# EAGLE design schematic (EAGLE 9.6.2)
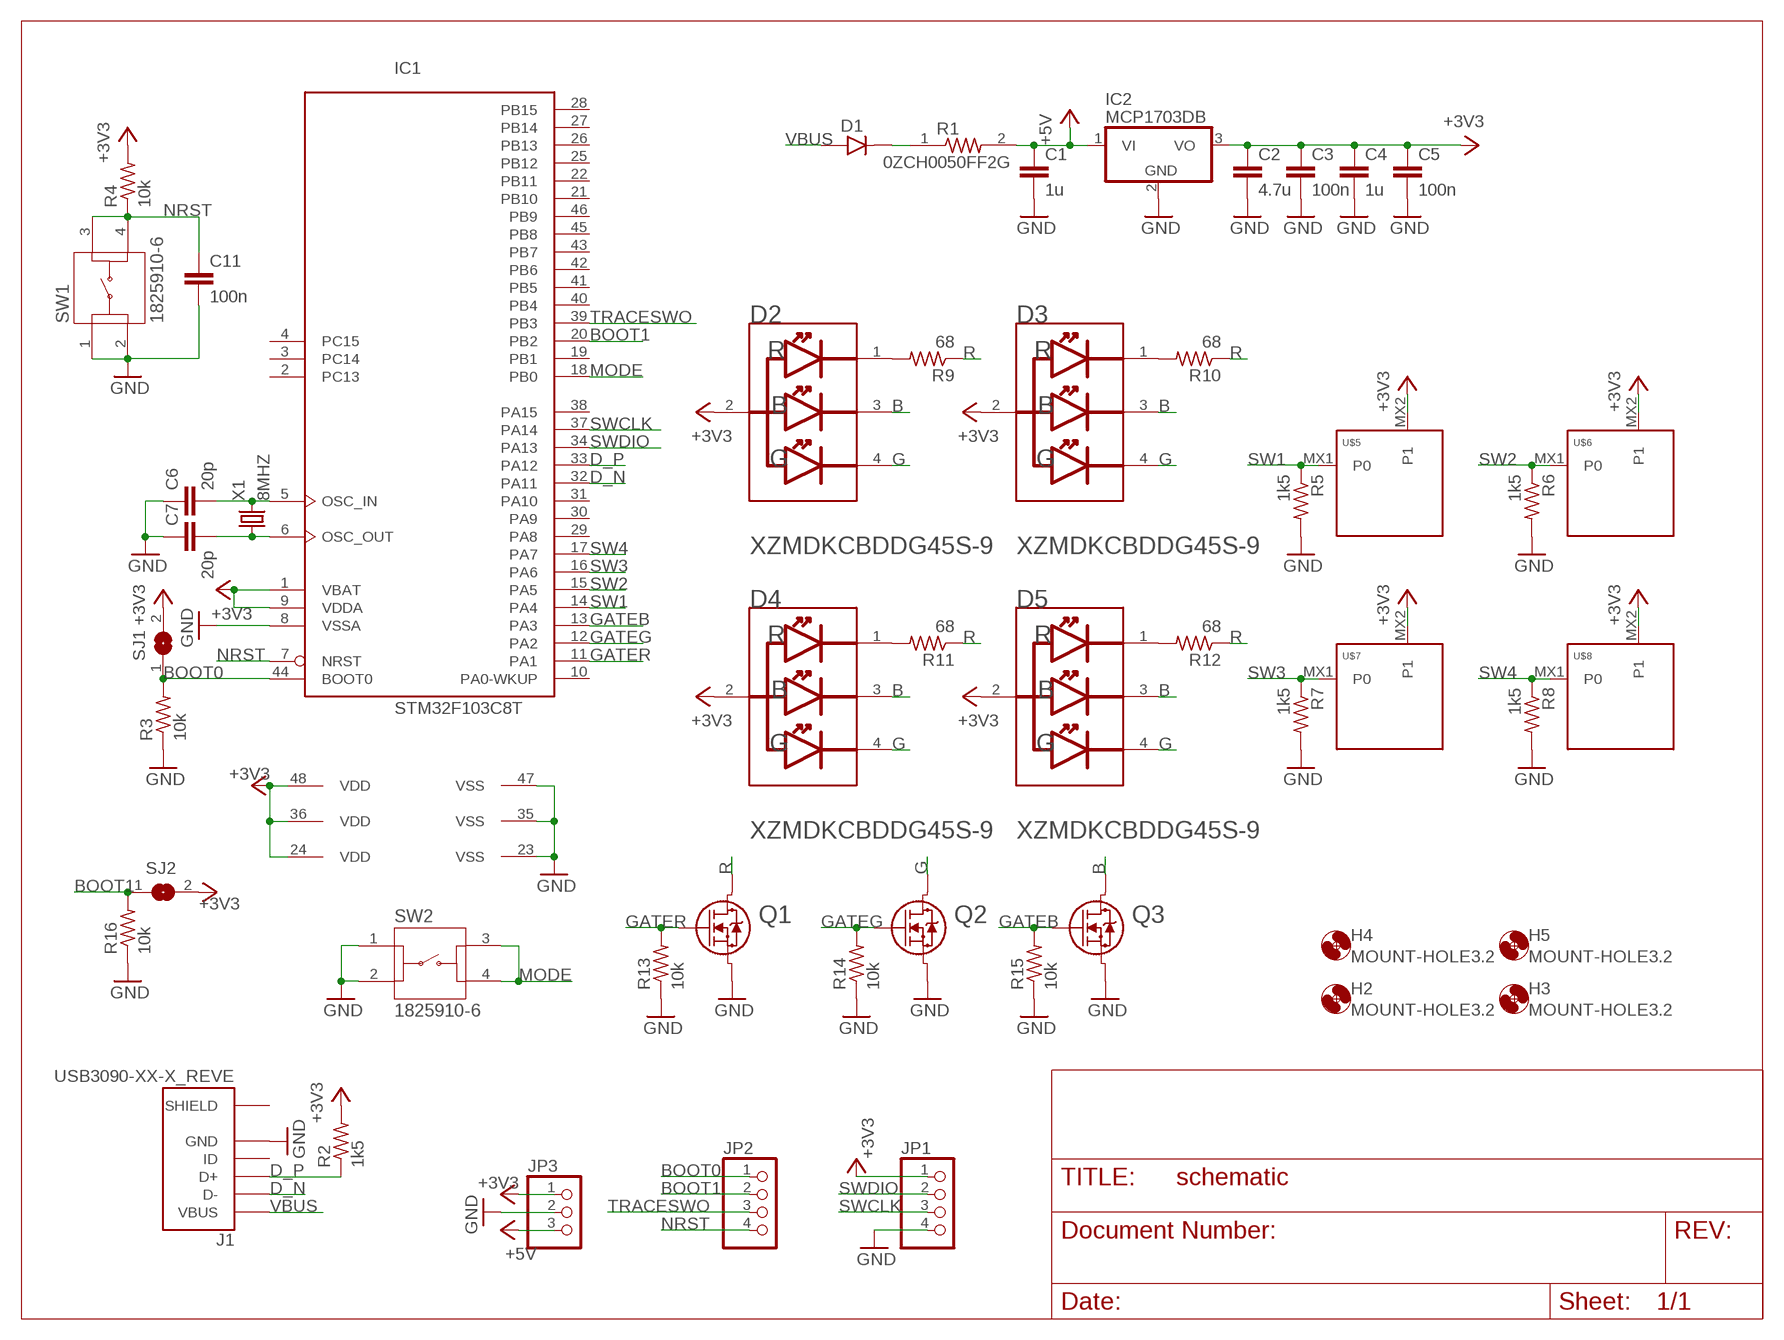
[diagram p0: schematic, sheet 1]

## Parts
C1  1u  C-EUC0805  [C0805]
C2  4.7u  C-EUC0805  [C0805]
C3  100n  C-EUC0805  [C0805]
C4  1u  C-EUC0805  [C0805]
C5  100n  C-EUC0805  [C0805]
C6  20p  C-EUC0805  [C0805]
C7  20p  C-EUC0805  [C0805]
C11  100n  C-EUC0805  [C0805]
D1  DIODE_SOD123FL  [SOD123FL]
D2  SUNLED_XZMDKCBDDG45S-9SUNLED_XZMDKCBDDG45S-9_0_0  [SUNLED_XZMDKCBDDG45S-9_0]
D3  SUNLED_XZMDKCBDDG45S-9SUNLED_XZMDKCBDDG45S-9_0_0  [SUNLED_XZMDKCBDDG45S-9_0]
D4  SUNLED_XZMDKCBDDG45S-9SUNLED_XZMDKCBDDG45S-9_0_0  [SUNLED_XZMDKCBDDG45S-9_0]
D5  SUNLED_XZMDKCBDDG45S-9SUNLED_XZMDKCBDDG45S-9_0_0  [SUNLED_XZMDKCBDDG45S-9_0]
H2  MOUNT-HOLE3.2  [3,2]
H3  MOUNT-HOLE3.2  [3,2]
H4  MOUNT-HOLE3.2  [3,2]
H5  MOUNT-HOLE3.2  [3,2]
IC1  STM32F103C8T  [LQFP48]
IC2  MCP1703DB  [SOT223]
J1  USB3090-XX-X_REVE  [GCT_USB3090-XX-X_REVE]
JP1  PINHD-1X4/90  [1X04/90]
JP2  PINHD-1X4/90  [1X04/90]
JP3  PINHD-1X3/90  [1X03/90]
Q1  RK7002BMT116TRANS_RK7002BMHZG_ROM-M  [TRANS_RK7002BMHZG_ROM-M]
Q2  RK7002BMT116TRANS_RK7002BMHZG_ROM-M  [TRANS_RK7002BMHZG_ROM-M]
Q3  RK7002BMT116TRANS_RK7002BMHZG_ROM-M  [TRANS_RK7002BMHZG_ROM-M]
R1  0ZCH0050FF2G  [RESC3225X75N]
R2  1k5  R-US_R0805  [R0805]
R3  10k  R-US_R0805  [R0805]
R4  10k  R-US_R0805  [R0805]
R5  1k5  R-US_R0805  [R0805]
R6  1k5  R-US_R0805  [R0805]
R7  1k5  R-US_R0805  [R0805]
R8  1k5  R-US_R0805  [R0805]
R9  68  R-US_R0805  [R0805]
R10  68  R-US_R0805  [R0805]
R11  68  R-US_R0805  [R0805]
R12  68  R-US_R0805  [R0805]
R13  10k  R-US_R0805  [R0805]
R14  10k  R-US_R0805  [R0805]
R15  10k  R-US_R0805  [R0805]
R16  10k  R-US_R0805  [R0805]
SJ1  SJ  [SJ]
SJ2  SJ  [SJ]
SW1  1825910-6  [SW_1825910-6-4]
SW2  1825910-6  [SW_1825910-6-4]
U$5  KEYSWITCH-PLAIN-MXHSPCB-1U  [MXHSPCB-1U]
U$6  KEYSWITCH-PLAIN-MXHSPCB-1U  [MXHSPCB-1U]
U$7  KEYSWITCH-PLAIN-MXHSPCB-1U  [MXHSPCB-1U]
U$8  KEYSWITCH-PLAIN-MXHSPCB-1U  [MXHSPCB-1U]
X1  8MHZ  CRYSTALHC49S  [HC49/S]

## Nets
+3V3 [Power]: C2.1 C3.1 C4.1 C5.1 D2.2(COMMON_ANODE) D3.2(COMMON_ANODE) D4.2(COMMON_ANODE) D5.2(COMMON_ANODE) IC1.1(VBAT) IC1.9(VDDA) IC1.24(VDD) IC1.36(VDD) IC1.48(VDD) IC2.3(VO) JP1.1 JP3.1 R2.2 R4.2 SJ1.2 SJ2.2 U$5.MX2(P1) U$6.MX2(P1) U$7.MX2(P1) U$8.MX2(P1)
+5V [Power]: C1.1 IC2.1(VI) JP3.3 R1.2
B [Power]: D2.3(BLUE_CATHODE) D3.3(BLUE_CATHODE) D4.3(BLUE_CATHODE) D5.3(BLUE_CATHODE) Q3.3
BOOT0: IC1.44(BOOT0) JP2.1 R3.2 SJ1.1
BOOT1: IC1.20(PB2) JP2.2 R16.2 SJ2.1
D_N [USBD]: IC1.32(PA11) J1.2(D-)
D_P [USBD]: IC1.33(PA12) J1.3(D+) R2.1
G [Power]: D2.4(GREEN_CATHODE) D3.4(GREEN_CATHODE) D4.4(GREEN_CATHODE) D5.4(GREEN_CATHODE) Q2.3
GATEB: IC1.13(PA3) Q3.1 R15.2
GATEG: IC1.12(PA2) Q2.1 R14.2
GATER: IC1.11(PA1) Q1.1 R13.2
GND: C1.2 C2.2 C3.2 C4.2 C5.2 C6.1 C7.1 C11.2 IC1.8(VSSA) IC1.23(VSS) IC1.35(VSS) IC1.47(VSS) IC2.2(GND) J1.5(GND) JP1.4 JP3.2 Q1.2 Q2.2 Q3.2 R3.1 R5.2 R6.2 R7.2 R8.2 R13.1 R14.1 R15.1 R16.1 SW1.1 SW1.2 SW2.1 SW2.2
MODE: IC1.18(PB0) SW2.3 SW2.4
N$1: D2.1(RED_CATHODE) R9.2
N$2: D1.C R1.1
N$3: C6.2 IC1.5(OSC_IN) X1.2
N$4: C7.2 IC1.6(OSC_OUT) X1.1
N$5: D3.1(RED_CATHODE) R10.2
N$6: D4.1(RED_CATHODE) R11.2
N$7: D5.1(RED_CATHODE) R12.2
NRST: C11.1 IC1.7(NRST) JP2.4 R4.1 SW1.3 SW1.4
R [Power]: Q1.3 R9.1 R10.1 R11.1 R12.1
SW1: IC1.14(PA4) R5.1 U$5.MX1(P0)
SW2: IC1.15(PA5) R6.1 U$6.MX1(P0)
SW3: IC1.16(PA6) R7.1 U$7.MX1(P0)
SW4: IC1.17(PA7) R8.1 U$8.MX1(P0)
SWCLK: IC1.37(PA14) JP1.3
SWDIO: IC1.34(PA13) JP1.2
TRACESWO: IC1.39(PB3) JP2.3
VBUS: D1.A J1.1(VBUS)
Unconnected: IC1.2(PC13) IC1.3(PC14) IC1.4(PC15) IC1.10(PA0-WKUP) IC1.19(PB1) IC1.21(PB10) IC1.22(PB11) IC1.25(PB12) IC1.26(PB13) IC1.27(PB14) IC1.28(PB15) IC1.29(PA8) IC1.30(PA9) IC1.31(PA10) IC1.38(PA15) IC1.40(PB4) IC1.41(PB5) IC1.42(PB6) IC1.43(PB7) IC1.45(PB8) IC1.46(PB9) J1.4(ID)

## Power pins joined to a net without a drawn wire
SHIELD: J1.6(SHIELD) J1.7(SHIELD) J1.8(SHIELD) J1.9(SHIELD)

## Library data of the parts
C1-C7 C11 = rcl:C-EU: CAPACITOR, European symbol; SPICEPREFIX: C
D1 = bt_diode:DIODE: Diode Collection of generic diodes in various packages
D2-D5 = SunLED - XZMDKCBDDG45S-9:SUNLED_XZMDKCBDDG45S-9: Red, Green, Blue (RGB) 630nm Red, 525nm Green, 465nm Blue LED Indication - Discrete 1.95V Red, 3.3V Green, 3.3V Blue 4-SMD, Gull Wing; AMBIENT_TEMPERATURE_RANGE_HIGH: +85°C; AMBIENT_TEMPERATURE_RANGE_LOW: -40°C; AUTOMOTIVE: No; CENTROID_NOT_SPECIFIED: No; COLOUR: Red, Blue, Green; DATASHEET: http://www.sunledusa.com/products/spec/XZMDKCBDDG45S-9.pdf; DEVICE_CLASS_L1: Optoelectronics; DEVICE_CLASS_L2: LEDs; DEVICE_CLASS_L3: unset; DIGIKEY_DESCRIPTION: LED RGB CLEAR 4PLCC SMD; DIGIKEY_PART_NUMBER: 1497-1257-1-ND; FOOTPRINT_VARIANT_NAME_0: Recommended_Land_Pattern; FORWARD_CURRENT: 20mA; FORWARD_VOLTAGE: 1.95/3.3/3.3V; HEIGHT: 2.1mm; LEAD_FREE: Yes; LED_ORIENTATION: Straight; LUMINOUS_INTENSITY: 108/98/497mcd; MF: SunLED; MFG_PACKAGE_IDENT: 0; MFG_PACKAGE_IDENT_DATE: 0; MFG_PACKAGE_IDENT_REV: 0; MOUNTING_TYPE: Surface Mount, Bottom Entry; MPN: XZMDKCBDDG45S-9; PACKAGE: SMD4; PEAK_EMMISION_WAVELENGTH: 645/460/515nm; POWER_DISSIPATION: 75/120/123mW; PREFIX: D; REVERSE_VOLTAGE: 5V; ROHS: Yes; TEMPERATURE_RANGE_HIGH: +85°C; TEMPERATURE_RANGE_LOW: -40°C; VERIFICATION_VERSION: 0.0.0.3; VIEWING_ANGLE: 120°; WAVELENGTH: 630/465/525nm
H2-H5 = holes:MOUNT-HOLE: MOUNTING HOLE with drill center marker
IC1 = micro-stm_v3:STM32F103C*T: ARM 32-bit Cortex™-M3 CPU 72 MHz maximum frequency 16 to 128 Kbytes of Flash memory 6 to 20 kbytes of SRAM 37 GPIOs 2.0 to 3.6 V application supply
IC2 = linear:MCP1703: 250 mA, 16V, Low Quiescent Current LDO Regulator Source: http://ww1.microchip.com/downloads/en/DeviceDoc/22049b.pdf
J1 = USB3090-XX-X_REVE:USB3090-XX-X_REVE: Micro USB Receptacle, Type AB, SMT, R/A, Bottom Mount, w/out Peg, w/outer shell stakes Check prices <https://pricing.snapeda.com/parts/USB3090-30-A/Global%20Connector%20Technology/view-part?ref=eda>; AVAILABILITY: Warning; DESCRIPTION: USB - micro AB USB 2.0 Receptacle Connector 5 Position Surface Mount, Right Angle; Through Hole, 2.35mm profile, 5 Pins, Horizontal, Bottom mount; MF: Global Connector Technology; MP: USB3090-30-A; PACKAGE: None; PRICE: None; PURCHASE-URL: https://pricing.snapeda.com/search/part/USB3090-30-A/?ref=eda
JP1 JP2 = pinhead:PINHD-1X4: PIN HEADER
JP3 = pinhead:PINHD-1X3: PIN HEADER
Q1-Q3 = RK7002BMT116:RK7002BMT116; BUILT_BY: EMA_Matt; COPYRIGHT: Copyright (C) 2018 Accelerated Designs. All rights reserved; MANUFACTURER_PART_NUMBER: RK7002BMT116; SOURCELIBRARY: Rohm_2019-09-23; VENDOR: ROHM Semiconductor
R1 = 0ZCH0050FF2G:0ZCH0050FF2G; DESCRIPTION: 1210 SMT PPTC | 0.50 Ih | 16V; DIGI-KEY_PART_NUMBER: 507-1786-1-ND; MF: Bel Fuse; MP: 0ZCH0050FF2G; PACKAGE: 1210 Bel Fuse; PURCHASE-URL: https://pricing.snapeda.com/search/part/0ZCH0050FF2G/?ref=eda
R2-R16 = rcl:R-US_: RESISTOR, American symbol; SPICEPREFIX: R
SJ1 SJ2 = jumper:SJ: SMD solder JUMPER
SW1 SW2 = 1825910-6:1825910-6: Switch Tactile OFF (ON) SPST Round Button PC Pins 0.05A 24VDC 100000Cycles 1.57N Thru-Hole Loose; COMMENT: 1825910-6; CONFIGURATION_POLE-THROW: Single Pole - Single Throw; CONTACT_CURRENT_RATING: 50 mA; DESCRIPTION: Switch Push Button OFF (ON) SPST Round Button 0.05A 24VDC Momentary Contact PC Pins Thru-Hole; DIGI-KEY_PART_NUMBER: 450-1650-ND; EU_ROHS_COMPLIANCE: Compliant; MF: TE Connectivity; MP: 1825910-6; PACKAGE: None; PURCHASE-URL: https://pricing.snapeda.com/search/part/1825910-6/?ref=eda
U$5-U$8 = Keyboard:KEYSWITCH-PLAIN
X1 = crystal:CRYSTAL: CRYSTAL; OC_FARNELL: 1667008; OC_NEWARK: unknown

## Board
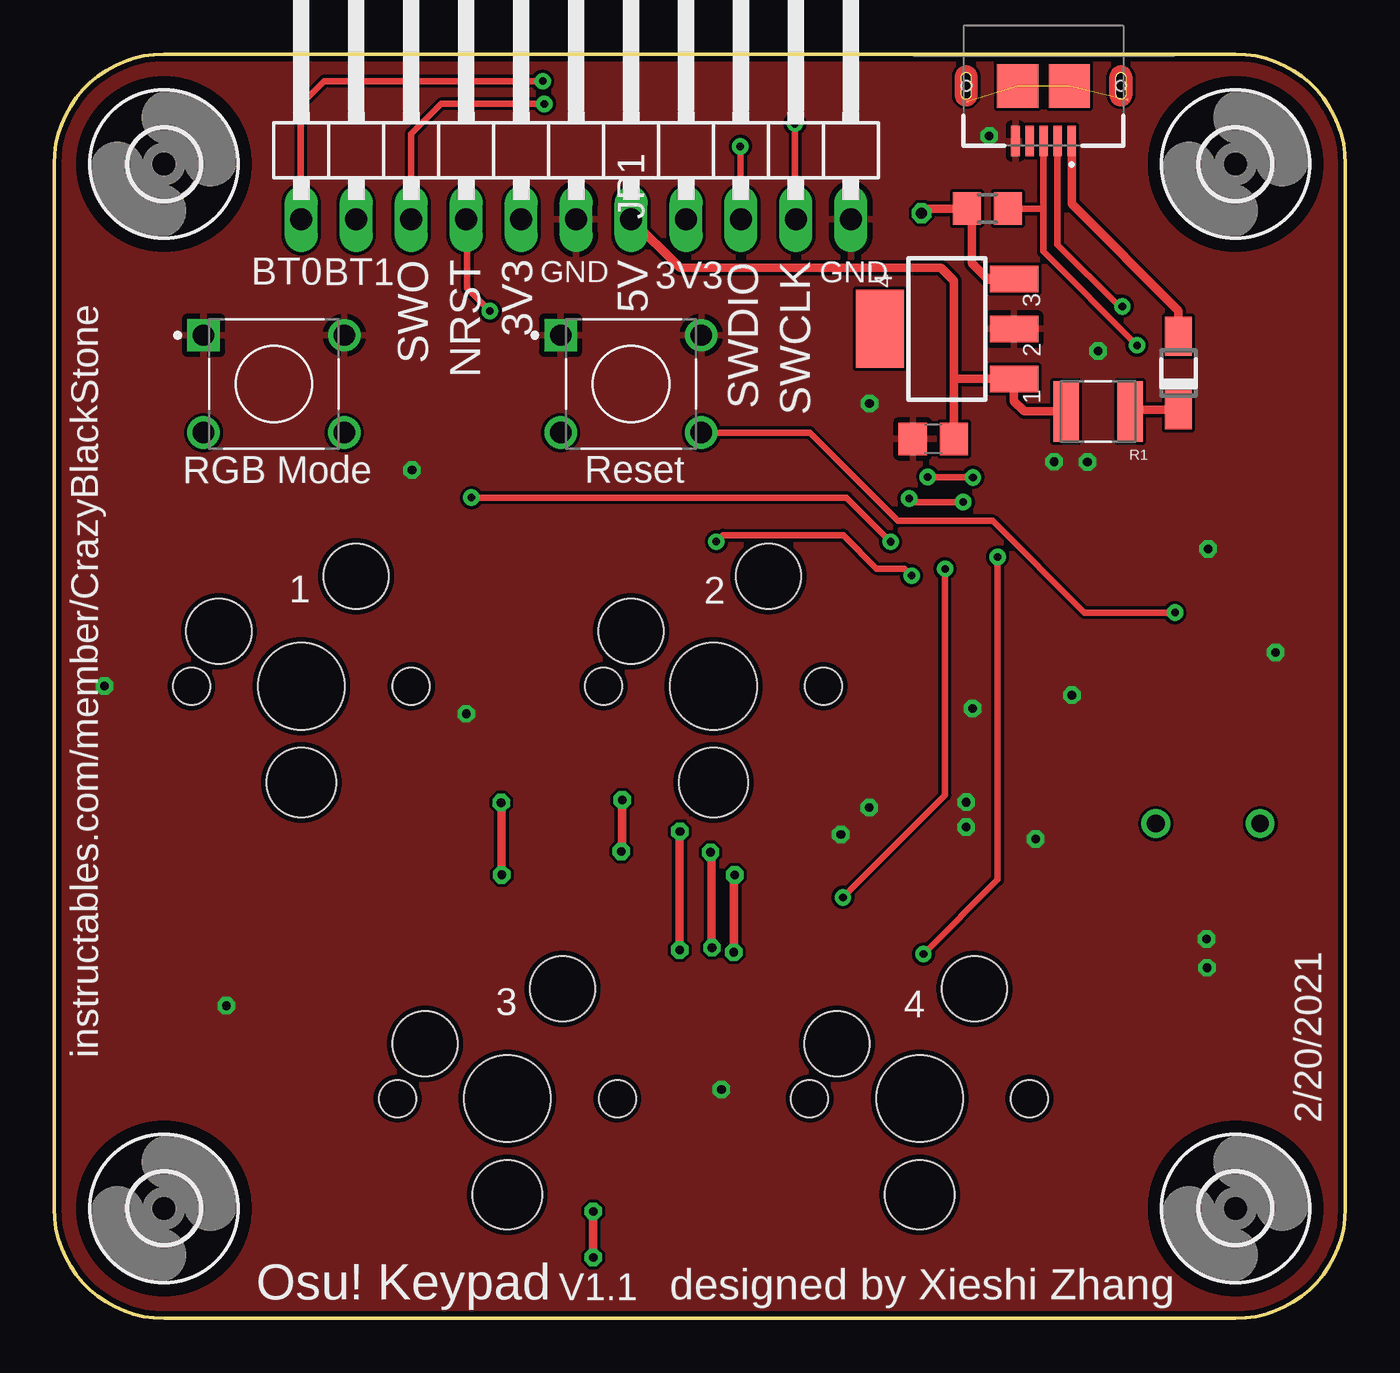
[diagram p1: board, top side]
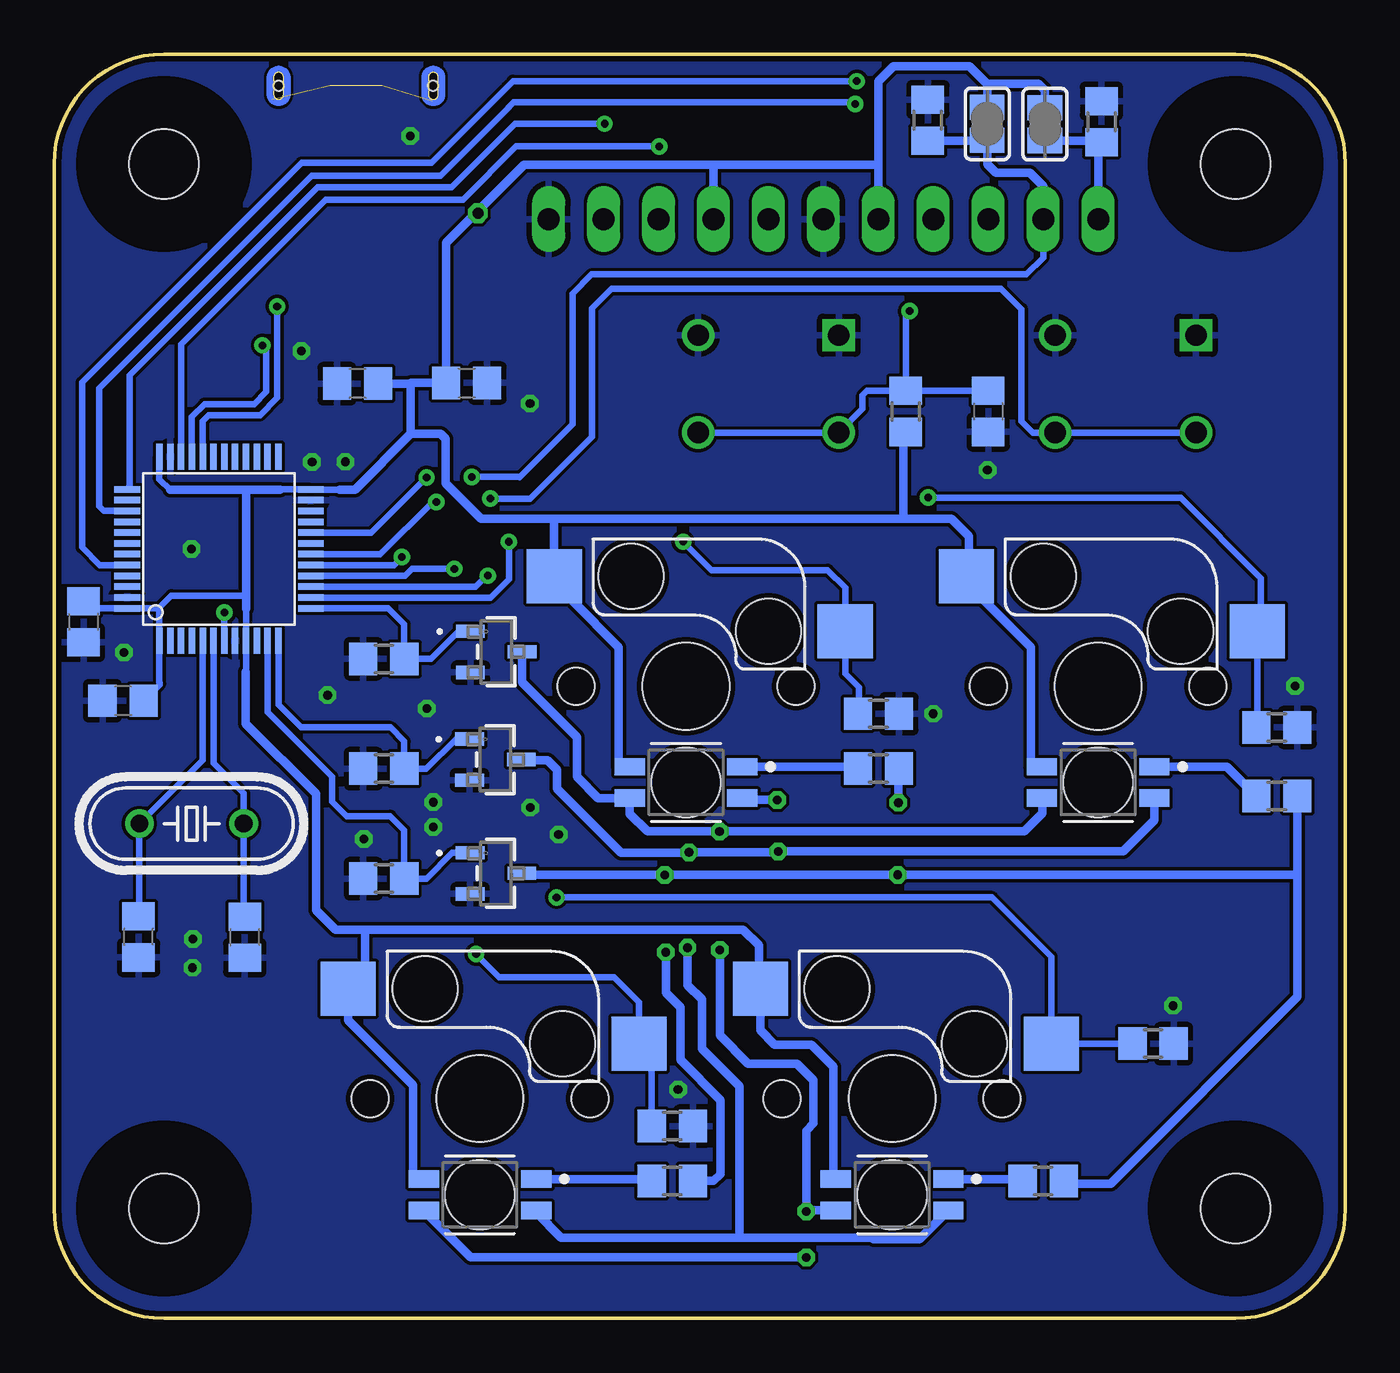
[diagram p2: board, bottom side, seen from below]

Size 59.69 x 58.42 mm. Coordinates in mm from the lower left corner, seen from the top.
Outline: 5.08,0 54.61,0 arc90 59.69,5.08 59.69,53.34 arc90 54.61,58.42 5.08,58.42 arc90 0,53.34 0,5.08 arc90 5.08,0
Copper layers (1*16): Top 0.035mm / dielectric 1.5mm / Bottom 0.035mm
Design rules "default *": minimum track width 6mil, minimum drill 0.3mm, track to track 6mil, track to pad 6mil, pad to pad 6mil, via to via 6mil, smd to smd 6mil, copper to edge 10mil, drill to drill 6mil, minimum pad ring 10mil, minimum via ring 8mil, stop-mask expansion 4mil, vias tented up to drill 20mil, thermal gap 10mil

### Footprints (pad centres in the part's own frame; a part is rotated, then mirrored left to right if it is on the bottom)
C0805 = smd 1.3 x 1.5: 1 -0.95,0; 2 0.95,0
SOD123FL = smd 1.8 x 1.25: A 1.7,0; C -1.7,0
SUNLED_XZMDKCBDDG45S-9_0 = smd 1.4 x 0.8: 1 2.6,0.725; 2 -2.6,0.725; 3 -2.6,-0.725; 4 2.6,-0.725 | hole 3.2: 0,0
3,2 = hole 3.2: 0,0
LQFP48 = smd 0.3 x 1.2: 1 -2.75,-4.25; 2 -2.25,-4.25; 3 -1.75,-4.25; 4 -1.25,-4.25; 5 -0.75,-4.25; 6 -0.25,-4.25; 7 0.25,-4.25; 8 0.75,-4.25; 9 1.25,-4.25; 10 1.75,-4.25; 11 2.25,-4.25; 12 2.75,-4.25; 25 2.75,4.25; 26 2.25,4.25; 27 1.75,4.25; 28 1.25,4.25; 29 0.75,4.25; 30 0.25,4.25; 31 -0.25,4.25; 32 -0.75,4.25; 33 -1.25,4.25; 34 -1.75,4.25; 35 -2.25,4.25; 36 -2.75,4.25 | smd 1.2 x 0.3: 13 4.25,-2.75; 14 4.25,-2.25; 15 4.25,-1.75; 16 4.25,-1.25; 17 4.25,-0.75; 18 4.25,-0.25; 19 4.25,0.25; 20 4.25,0.75; 21 4.25,1.25; 22 4.25,1.75; 23 4.25,2.25; 24 4.25,2.75; 37 -4.25,2.75; 38 -4.25,2.25; 39 -4.25,1.75; 40 -4.25,1.25; 41 -4.25,0.75; 42 -4.25,0.25; 43 -4.25,-0.25; 44 -4.25,-0.75; 45 -4.25,-1.25; 46 -4.25,-1.75; 47 -4.25,-2.25; 48 -4.25,-2.75
SOT223 = smd 1.219 x 2.235: 1 -2.311,-3.099; 2 0,-3.099; 3 2.311,-3.099 | smd 3.6 x 2.2: 4 0,3.099
GCT_USB3090-XX-X_REVE = smd 0.4 x 1.4: 1 -1.3,2.55; 2 -0.65,2.55; 3 0,2.55; 4 0.65,2.55; 5 1.3,2.55 | smd 0.1 x 0.1: 6 -3.87,0.63; 7 3.51,0.72 | smd 1.9 x 2: 8 -1.2,0; 9 1.2,0 | hole 0.45: -3.575,0; 3.575,0
1X04/90 = drill 1.016 long: 1 -3.81,-3.81; 2 -1.27,-3.81; 3 1.27,-3.81; 4 3.81,-3.81
1X03/90 = drill 1.016 long: 1 -2.54,-3.81; 2 0,-3.81; 3 2.54,-3.81
TRANS_RK7002BMHZG_ROM-M = smd 0.61 x 1.321: 1 -0.95,-1.194; 2 0.95,-1.194; 3 0,1.194
RESC3225X75N = smd 1.18 x 2.81: 1 -1.484,0; 2 1.484,0
R0805 = smd 1.3 x 1.5: 1 -0.95,0; 2 0.95,0
SJ = smd 1.168 x 1.6: 1 -0.762,0; 2 0.762,0
SW_1825910-6-4 = drill 0.99 square: 1 -3.25,2.25 | drill 0.99: 2 3.25,2.25; 3 -3.25,-2.25; 4 3.25,-2.25
MXHSPCB-1U = smd 2.55 x 2.5: MX1 7.36,2.54; MX2 -6.09,5.08 | hole 4: 0,0 | hole 1.7: 5.08,0; -5.08,0 | hole 3: 3.81,2.54; -2.54,5.08
HC49/S = drill 0.813: 1 -2.413,0; 2 2.413,0

### Placement (x,y rotation side)
C1  40.64,40.64 180 top
C2  40.62,43.22 0 bottom
C3  58.33,32.19 270 bottom
C4  56.5,28.54 180 bottom
C5  45.66,43.2 180 bottom
C6  55.79,17.63 90 bottom
C7  50.87,17.61 90 bottom
C11  16.51,41.91 270 bottom
D1  51.97,43.68 90 top
D2  11.43,24.77 0 bottom
D3  30.48,24.77 0 bottom
D4  20.95,5.71 0 bottom
D5  40.01,5.71 0 bottom
H2  5.08,5.08 0 top
H3  54.61,5.08 0 top
H4  5.08,53.34 0 top
H5  54.61,53.34 0 top
IC1  52.07,35.56 0 bottom
IC2  41.27,45.72 90 top
J1  45.74,56.95 180 top
JP1  33.02,54.61 0 top
JP2  15.24,54.61 0 top
JP3  24.13,54.61 0 top
Q1  39.27,20.56 270 bottom
Q2  39.29,25.82 270 bottom
Q3  39.25,30.8 270 bottom
R1  48.26,41.91 180 top
R2  43.14,51.28 180 top
R3  11.28,55.3 270 bottom
R4  20.32,41.91 270 bottom
R5  3.17,27.3 0 bottom
R6  21.59,27.94 0 bottom
R7  8.89,12.7 0 bottom
R8  31.11,8.89 0 bottom
R9  3.17,24.13 180 bottom
R10  21.59,25.4 180 bottom
R11  13.97,6.35 180 bottom
R12  31.11,6.35 180 bottom
R13  44.45,20.32 0 bottom
R14  44.45,25.4 0 bottom
R15  44.45,30.48 0 bottom
R16  19.3,55.36 270 bottom
SJ1  13.89,55.18 90 bottom
SJ2  16.55,55.2 90 bottom
SW1  26.67,43.18 0 top
SW2  10.16,43.18 0 top
U$5  11.43,29.21 0 bottom
U$6  30.48,29.21 0 bottom
U$7  20.95,10.16 0 bottom
U$8  40.01,10.16 0 bottom
X1  53.34,22.86 180 bottom

### Tracks (layer width: path | path; a pad name or v marks a point on that pad's centre or on a via)
+3V3  (via drill 0.5)
  Top 0.4: IC2.3 44.34,47.99 43.2,47.99 42.42,48.77 42.42,51.05 R2.2 40.31,51.28 v40.09,51.06
  Bottom 0.3: 46.49,38.3 47.81,38.3 IC1.24 49.23,38.31 49.24,38.3 | 50.83,29.88 50.82,29.89 IC1.9 50.82,32.77 50.81,32.78 | 54.33,38.29 54.82,38.78 IC1.36 | 54.85,32.81 IC1.48 58,32.81 C3.1 | 54.85,32.81 54.82,32.78 IC1.1 54.82,29.39 54.81,29.38 54.81,29.28 C4.1 | 54.85,32.81 54.27,33.4 50.81,33.4
  Bottom 0.4: D3.2 33.59,25.49 33.59,31.02 35.74,33.16 35.74,33.46 U$6.MX2 36.57,36.95 | 43.2,43.2 43.2,43.19 43.2,43.18 43.2,40.87 | 43.2,40.87 45.77,38.3 46.49,38.3 | 43.2,40.87 41.82,40.87 41.59,40.64 41.59,38.58 39.96,36.95 36.57,36.95 | D2.2 14.53,25.49 14.53,31.01 16.69,33.16 16.69,33.46 17.39,34.16 | 17.39,34.16 U$5.MX2 | D5.2 43.09,6.44 43.09,10.77 46.09,13.78 U$8.MX2 45.31,16.02 45.31,17.97 | 36.57,36.95 20.42,36.95 | 20.42,36.95 18.2,36.95 17.39,36.15 17.39,34.16 | 29.24,53.3 21.59,53.3 | JP3.1 21.59,53.3 | JP1.1 29.21,53.27 29.24,53.3 | 21.59,53.3 21.59,57.17 20.89,57.87 17.39,57.87 16.57,57.04 16.55,57.04 | SJ2.2 16.55,57.04 | 16.55,57.04 14.19,57.04 13.89,56.74 SJ1.2 | 50.83,29.88 50.83,27.48 47.58,24.24 47.58,18.87 46.68,17.97 45.31,17.97 | 45.31,17.97 27.84,17.97 27.11,17.24 27.11,15.31 U$7.MX2 27.05,13.31 26.38,12.65 24.69,12.65 23.67,11.63 23.67,6.58 23.55,6.47 D4.2 | R4.2 20.42,40.86 20.42,36.95 | 49.24,38.3 49.23,38.29 50.87,38.29 | 54.33,38.29 50.87,38.29 | 50.81,32.78 50.81,33.4 50.81,38.23 50.87,38.29 | 29.24,53.3 37.98,53.3 40.09,51.18 v40.09,51.06 40.2,51.06 41.57,49.69 C2.1 43.18,43.22 43.2,43.2 | 43.2,43.2 C5.1
+5V
  Top 0.4: R1.2 44.85,41.91 44.37,42.39 IC2.1 41.59,43.41 | JP3.3 28.92,48.55 40.99,48.55 41.59,47.94 41.59,43.41 | 41.59,43.41 C1.1
B  (via drill 0.4)
  Top 0.4: v24.92,4.95 v24.92,2.82 | v28.91,17.02 28.91,22.48 v28.93,22.5
  Bottom 0.4: D4.3 24.88,4.99 v24.92,4.95 | v24.92,4.95 | v24.92,2.82 40.44,2.82 D5.3 | D2.3 14.01,24.02 14.01,23.33 14.85,22.5 v28.93,22.5 32.25,22.5 33.08,23.33 D3.3 34.54,24.04 35.52,25.02 35.52,26.85 38.06,29.39 Q3.3 | v24.92,4.95 24.92,8.68 24.59,9.01 24.59,11 25.36,11.77 27.61,11.77 28.91,13.08 v28.91,17.02
BOOT0  (via drill 0.35)
  Top 0.3: v22.59,57.17 12.49,57.17 11.4,56.07 11.4,50.83 JP2.1
  Bottom 0.3: IC1.44 57.58,34.81 58.39,35.62 58.39,43.26 48.25,53.4 42.23,53.4 38.77,56.87 38.77,56.88 38.48,57.17 v22.59,57.17
  Bottom 0.4: JP2.1 11.43,54.19 R3.2 11.35,54.42 SJ1.1
BOOT1  (via drill 0.35)
  Top 0.3: v42.47,38.86 40.41,38.86 v40.39,38.89
  Bottom 0.3: IC1.20 45.02,36.31 v42.47,38.86 | v40.39,38.89 38.19,38.89 38.18,38.88 35.73,41.32 35.73,47.35 34.84,48.24 14.75,48.24 13.97,49.01 JP2.2
  Bottom 0.4: JP2.2 13.97,52.32 14.59,52.94 16.16,52.94 16.55,53.34 SJ2.1 16.58,54.41 R16.2
D_N  (via drill 0.35)
  Top 0.3: v49.38,46.76 49.23,46.76 46.39,49.61 J1.2
  Bottom 0.3: v49.38,46.76 49.38,42.72 | 49.38,42.72 | 49.38,42.72 49.38,42.53 50.17,41.74 50.35,41.74 | 50.35,41.74 | 50.35,41.74 52.54,41.74 52.82,41.47 IC1.32
D_P  (via drill 0.35)
  Top 0.3: v50.06,44.96 45.72,49.3 45.72,51.28 | J1.3 45.74,52.02 45.72,52.04 45.72,51.28 | R2.1 45.72,51.28
  Bottom 0.3: v50.06,44.96 49.89,44.8 49.89,42.81 50.45,42.25 52.74,42.25 53.32,41.67 IC1.33
G  (via drill 0.4)
  Top 0.4: v26.26,23.95 26.26,21.62 v26.22,21.58 | v30.34,21.54 30.39,21.5 30.39,17.16 v30.41,17.13
  Bottom 0.4: 28.01,3.74 21.88,3.74 21.81,3.66 19.68,3.66 D4.4 | 28.01,3.74 36.25,3.74 37.41,4.9 D5.4 | D2.4 8.83,23.01 10.26,21.58 v26.22,21.58 26.27,21.53 v30.34,21.53 v30.34,21.54 30.36,21.51 33.47,21.51 36.44,24.48 36.44,25.34 36.88,25.79 38.07,25.79 Q2.3 | D3.4 27.79,23.95 v26.26,23.95 | 28.01,3.74 28.01,10.73 29.75,12.46 29.75,14.74 30.41,15.4 v30.41,17.13
GATEB
  Bottom 0.3: IC1.13 44.24,32.81 43.5,32.07 R15.2 42.27,30.48 41,31.75 Q3.1
GATEG
  Bottom 0.3: IC1.12 49.32,28.36 48.26,27.3 44.14,27.3 43.5,26.66 R14.2 42.48,25.4 41.11,26.77 Q2.1
GATER
  Bottom 0.3: IC1.11 49.82,28.01 46.84,25.03 46.84,23.88 46.17,23.2 44.15,23.2 43.5,22.55 R13.2 42.48,20.32 41.28,21.51 Q1.1
GND  (via drill 0.4)
  other vias: 19.05,27.94 16.55,39.2 30.85,10.58 53.29,16.2 53.27,17.53 43.23,54.64 7.97,14.45 2.33,29.22 37.69,42.27 48.25,44.7 46.22,39.58 47.76,39.57 42.15,22.7 42.45,28.19 37.68,23.6 36.37,22.36 42.17,23.85 45.37,22.15 47.05,28.8 56.46,30.78 53.34,35.56
  pour Bottom: -3.81,-3.81 62.23,-3.81 64.77,-1.27 64.77,60.96 63.5,62.23 62.23,63.5 -1.27,63.5 -3.81,60.96
  pour Top: -3.81,-3.81 62.23,-3.81 64.77,-1.27 64.77,60.96 62.23,63.5 -1.27,63.5 -3.81,60.96
MODE  (via drill 0.35)
  Top 0.3: v42.02,37.72 39.69,37.72 v39.52,37.88
  Bottom 0.3: SW2.3 SW2.4 14.44,40.93 14.97,41.45 14.97,46.63 15.91,47.58 33.93,47.58 34.84,46.68 34.84,40.73 37.68,37.88 v39.52,37.88 | IC1.18 44.61,35.31 42.2,37.72 v42.02,37.72
N$1
  Bottom 0.4: D2.1 5.49,25.49 R9.2
N$2
  Top 0.4: D1.C 49.74,41.98 R1.1
N$3
  Bottom 0.3: IC1.5 52.82,25.79 X1.2 55.75,18.61 C6.2
N$4
  Bottom 0.3: IC1.6 52.32,25.66 50.93,24.27 X1.1 50.93,18.62 C7.2
N$5
  Bottom 0.4: R10.2 22.63,25.49 D3.1
N$6
  Bottom 0.4: D4.1 15.01,6.44 R11.2
N$7
  Bottom 0.4: D5.1 32.16,6.44 R12.2
NRST  (via drill 0.35)
  Top 0.3: v20.15,46.54 19.1,47.59 19.1,50.75 JP2.4 | v51.81,32.62 47.63,32.62 43.39,36.86 39.01,36.86 34.93,40.93 SW1.4
  Bottom 0.3: SW1.4 SW1.3 22.32,42.03 22.32,42.66 22.11,42.86 R4.1 | R4.1 C11.1 | R4.1 20.32,46.37 v20.15,46.54 | IC1.7 51.82,32.61 v51.81,32.62
R  (via drill 0.4)
  Top 0.4: v20.69,20.5 20.69,23.8 v20.66,23.83 | v31.47,20.49 31.42,20.44 v31.42,16.93 v31.41,16.92
  Bottom 0.4: R9.1 2.23,20.39 | 2.23,20.39 2.23,14.86 10.85,6.23 12.9,6.23 R11.1 | v20.66,23.83 20.66,25.38 R10.1 | 2.23,20.39 2.33,20.5 v20.69,20.5 v20.7,20.49 v31.47,20.49 38,20.49 Q1.3 | R12.1 29.21,6.35 28.89,6.67 28.89,10.09 30.74,11.95 30.74,14.38 31.41,15.05 v31.41,16.92
SHIELD  (3 unrouted)
SW1  (via drill 0.35)
  Top 0.3: v38.66,35.89 36.63,37.92 v19.29,37.92
  Bottom 0.3: U$5.MX1 4.07,31.6 | 4.07,31.6 4.07,27.36 R5.1 | IC1.14 39.52,33.31 38.66,34.16 v38.66,35.89 | v19.29,37.92 7.61,37.92 3.9,34.21 3.9,31.77 4.07,31.6
SW2  (via drill 0.35)
  Top 0.3: v30.61,35.89 30.92,36.19 36.48,36.19 38.02,34.65 39.31,34.65 v39.64,34.32
  Bottom 0.3: IC1.15 40.22,33.8 39.67,34.35 v39.64,34.32 | v30.61,35.89 29.3,34.58 23.93,34.58 23.12,33.77 U$6.MX1 23.12,29.79 22.49,29.16 22.49,27.99 R6.1
SW3  (via drill 0.35)
  Top 0.3: v36.46,19.46 41.19,24.18 v41.19,34.64
  Bottom 0.3: R7.1 U$7.MX1 13.6,16.71 16.34,19.46 v36.46,19.46 | v41.19,34.64 43.13,34.64 43.46,34.3 IC1.16
SW4  (via drill 0.35)
  Top 0.3: v43.61,35.18 43.61,20.26 v40.19,16.83
  Bottom 0.3: R8.1 32.06,12.12 U$8.MX1 32.65,14.61 33.8,15.77 39.12,15.77 v40.19,16.83 | IC1.17 43.98,34.81 v43.61,35.18
SWCLK  (via drill 0.35)
  Top 0.3: v34.24,55.2 34.24,50.85 JP1.3
  Bottom 0.3: IC1.37 56.19,38.44 56.19,43.58 47.51,52.26 41.32,52.26 38.37,55.2 v34.24,55.2
SWDIO  (via drill 0.35)
  Top 0.3: v31.72,54.16 31.72,50.83 JP1.2
  Bottom 0.3: IC1.34 53.82,45.01 47.14,51.69 40.8,51.69 38.33,54.16 v31.72,54.16
TRACESWO  (via drill 0.35)
  Top 0.3: v22.66,56.12 17.89,56.12 16.51,54.74 JP2.3
  Bottom 0.3: IC1.39 57.38,37.31 57.6,37.53 57.6,42.98 55.41,45.17 | v22.66,56.12 22.74,56.2 38.45,56.2 38.69,55.96 38.69,55.94 41.82,52.81 47.78,52.81 55.41,45.17 | 55.41,45.17
VBUS
  Top 0.4: J1.1 47.04,51.49 51.97,46.56 D1.A

### Text on the board
tNames: SWO | NRST | 3V3 | GND | BT0 | BT1 | 3V3 | GND | 5V | SWDIO | SWCLK | RGB Mode | Reset | 1 | 2 | 3 | 4 | instructables.com/member/CrazyBlackStone | 2/20/2021 | Osu! Keypad | V1.1 | designed by Xieshi Zhang